# EAGLE schematic MainBoard (EAGLE 9.6.2)
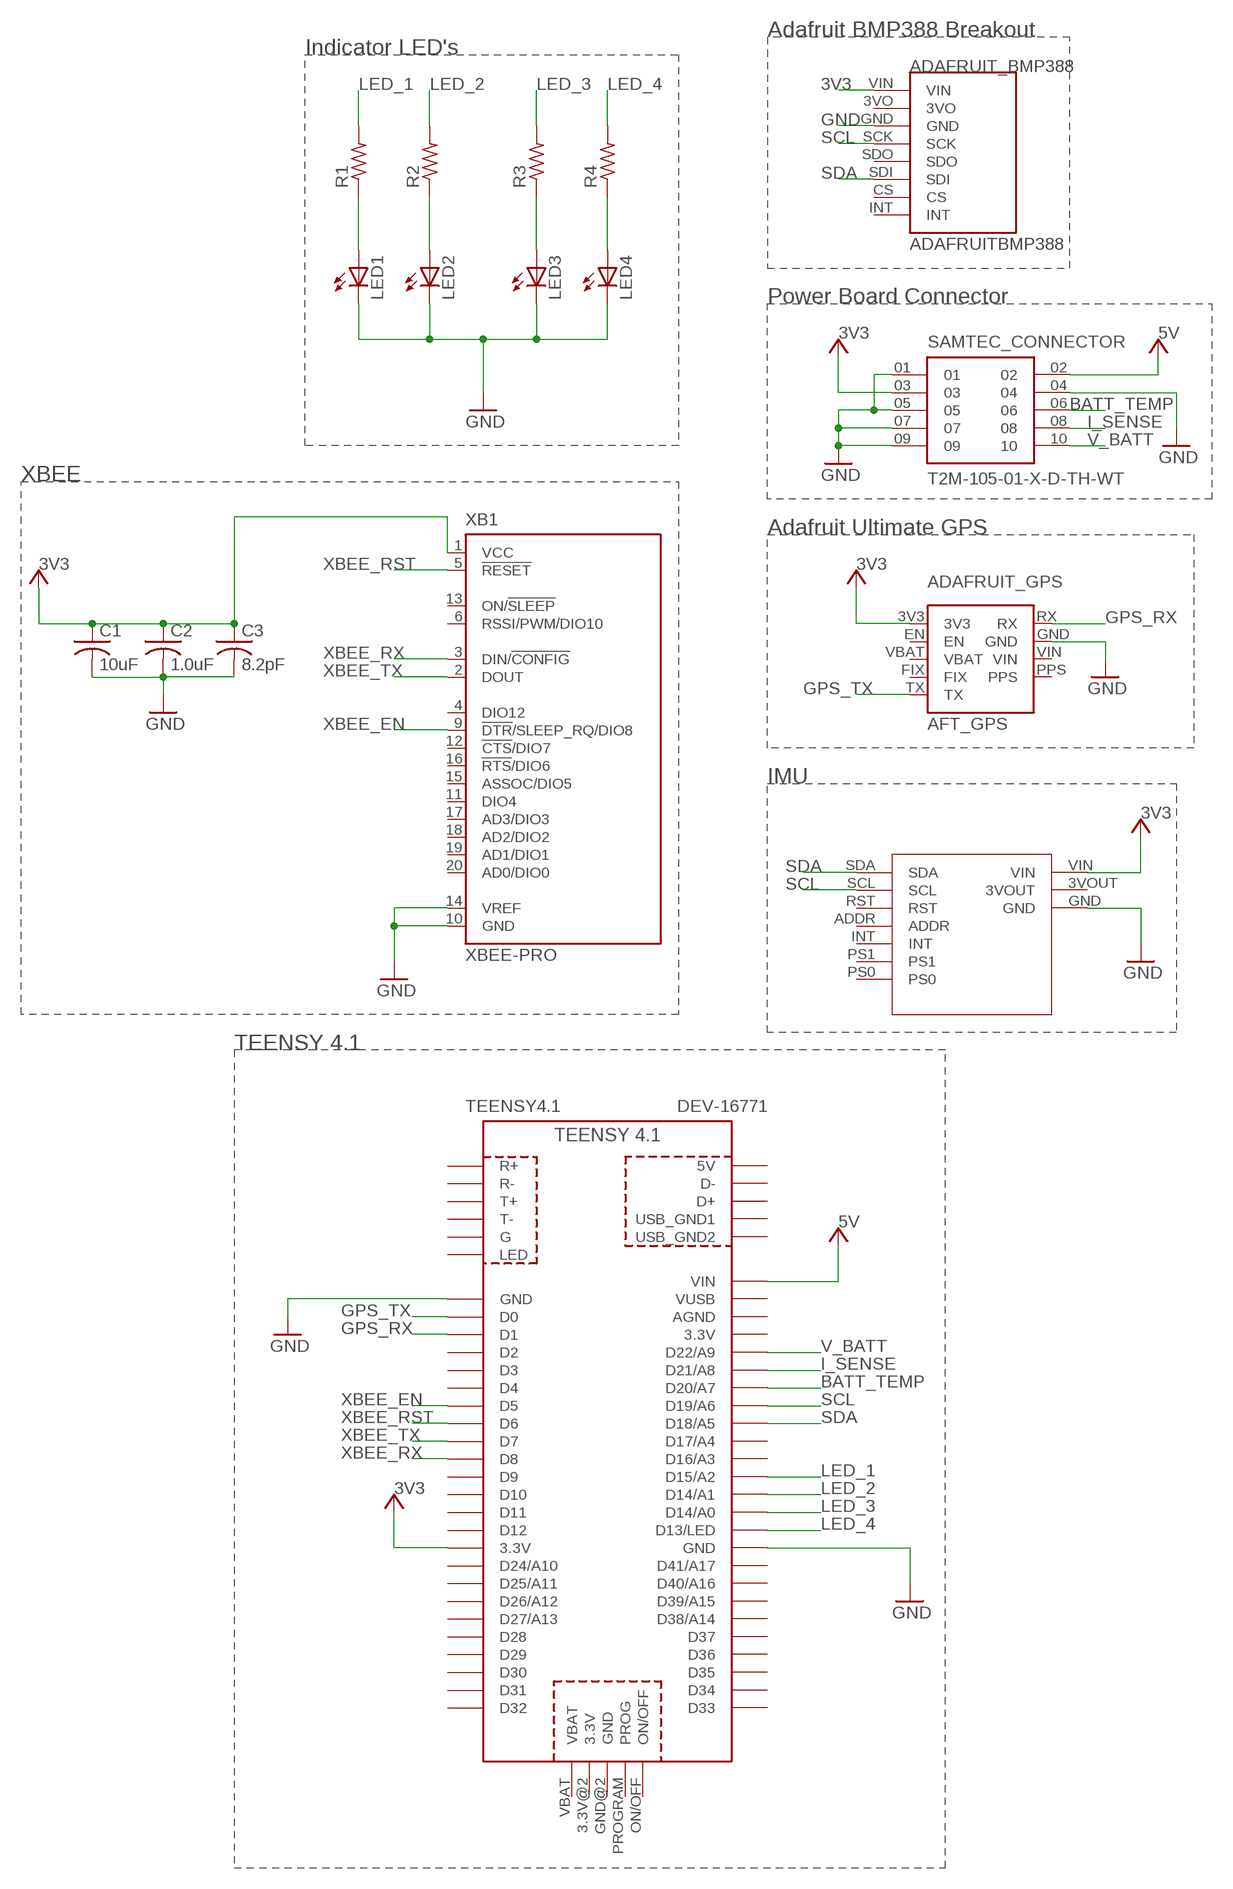
[diagram p0: schematic, sheet 1]

## Parts
ADAFRUIT_BMP388  ADAFRUITBMP388  [ADAFRUITBMP388]
ADAFRUIT_GPS  AFT_GPS  [AFT_GPS]
C1  10uF  C-USC0805  [C0805]
C2  1.0uF  C-USC0805  [C0805]
C3  8.2pF  C-USC0805  [C0805]
LED1  LED5MM  [LED5MM]
LED2  LED5MM  [LED5MM]
LED3  LED5MM  [LED5MM]
LED4  LED5MM  [LED5MM]
R1  R-US_R0805  [R0805]
R2  R-US_R0805  [R0805]
R3  R-US_R0805  [R0805]
R4  R-US_R0805  [R0805]
SAMTEC_CONNECTOR  T2M-105-01-X-D-TH-WT  [SAMTEC_T2M-105-01-X-D-TH-WT]
TEENSY4.1  DEV-16771  [DEV-16771]
U$1  IMU_BREAKOUT  [BNO055_BREAKOUT]
XB1  XBEE-PRO  [XBEE-PRO]

## Nets
3V3: ADAFRUIT_BMP388.VIN ADAFRUIT_GPS.3V3 C1.1 C2.1 C3.1 SAMTEC_CONNECTOR.03 TEENSY4.1.3.3V U$1.VIN XB1.1(VCC) ; supply symbol labelled VCC
5V: SAMTEC_CONNECTOR.02 TEENSY4.1.VIN ; supply symbol labelled VCC
BATT_TEMP: SAMTEC_CONNECTOR.06 TEENSY4.1.D21/A7(D20/A7)
GND: ADAFRUIT_BMP388.GND ADAFRUIT_GPS.GND C1.2 C2.2 C3.2 LED1.K(C) LED2.K(C) LED3.K(C) LED4.K(C) SAMTEC_CONNECTOR.01 SAMTEC_CONNECTOR.04 SAMTEC_CONNECTOR.05 SAMTEC_CONNECTOR.07 SAMTEC_CONNECTOR.09 TEENSY4.1.GND TEENSY4.1.GND@1(GND) U$1.GND XB1.10(GND) XB1.14(VREF)
GPS_RX: ADAFRUIT_GPS.RX TEENSY4.1.D1
GPS_TX: ADAFRUIT_GPS.TX TEENSY4.1.D0
I_SENSE: SAMTEC_CONNECTOR.08 TEENSY4.1.D22/A8(D21/A8)
LED_1: R1.2 TEENSY4.1.D16/A2(D15/A2)
LED_2: R2.2 TEENSY4.1.D15/A1(D14/A1)
LED_3: R3.2 TEENSY4.1.D14/A0
LED_4: R4.2 TEENSY4.1.D13/LED
N$8: LED1.A R1.1
N$9: LED2.A R2.1
N$10: LED3.A R3.1
N$11: LED4.A R4.1
SCL: ADAFRUIT_BMP388.SCK TEENSY4.1.D20/A6(D19/A6) U$1.SCL
SDA: ADAFRUIT_BMP388.SDI TEENSY4.1.D19/A5(D18/A5) U$1.SDA
V_BATT: SAMTEC_CONNECTOR.10 TEENSY4.1.D23/A9(D22/A9)
XBEE_EN: TEENSY4.1.D5 XB1.9(!DTR!/SLEEP_RQ/DIO8)
XBEE_RST: TEENSY4.1.D6 XB1.5(!RESET)
XBEE_RX: TEENSY4.1.D8 XB1.3(DIN/!CONFIG)
XBEE_TX: TEENSY4.1.D7 XB1.2(DOUT)
Unconnected: ADAFRUIT_BMP388.3VO ADAFRUIT_BMP388.CS ADAFRUIT_BMP388.INT ADAFRUIT_BMP388.SDO ADAFRUIT_GPS.EN ADAFRUIT_GPS.FIX ADAFRUIT_GPS.PPS ADAFRUIT_GPS.VBAT ADAFRUIT_GPS.VIN TEENSY4.1.D2 TEENSY4.1.D3 TEENSY4.1.D4 TEENSY4.1.D9 TEENSY4.1.D10 TEENSY4.1.D11 TEENSY4.1.D12 TEENSY4.1.D17/A3(D16/A3) TEENSY4.1.D18/A4(D17/A4) TEENSY4.1.D24/A10 TEENSY4.1.D25/A11 TEENSY4.1.D26/A12 TEENSY4.1.D27/A13 TEENSY4.1.D28 TEENSY4.1.D29 TEENSY4.1.D30 TEENSY4.1.D31 TEENSY4.1.D32 TEENSY4.1.D33 TEENSY4.1.D34 TEENSY4.1.D35 TEENSY4.1.D36 TEENSY4.1.D37 TEENSY4.1.D38/A14 TEENSY4.1.D39/A15 TEENSY4.1.D40/A16 TEENSY4.1.D41/A17 TEENSY4.1.D+ TEENSY4.1.D- TEENSY4.1.LED TEENSY4.1.ON/OFF TEENSY4.1.PROGRAM(PROG) TEENSY4.1.R+ TEENSY4.1.R- TEENSY4.1.T+ TEENSY4.1.T- U$1.3VOUT U$1.ADDR U$1.INT U$1.PS0 U$1.PS1 U$1.RST XB1.4(DIO12) XB1.6(RSSI/PWM/DIO10) XB1.11(DIO4) XB1.12(!CTS!/DIO7) XB1.13(ON/!SLEEP) XB1.15(ASSOC/DIO5) XB1.16(!RTS!/DIO6) XB1.17(AD3/DIO3) XB1.18(AD2/DIO2) XB1.19(AD1/DIO1) XB1.20(AD0/DIO0)

## Notes on the sheet
- Adafruit BMP388 Breakout
- Indicator LED's
- Power Board Connector
- XBEE
- Adafruit Ultimate GPS
- IMU
- TEENSY 4.1

## Power pins joined to a net without a drawn wire
3.3V: TEENSY4.1.3.3V@1(3.3V) TEENSY4.1.3.3V@2(3.3V)
5V: TEENSY4.1.5V
AGND: TEENSY4.1.AGND
G: TEENSY4.1.G
GND: TEENSY4.1.GND@2(GND)
USB_GND1: TEENSY4.1.USB_GND(USB_GND1)
USB_GND2: TEENSY4.1.USB_GND@2(USB_GND2)
VBAT: TEENSY4.1.VBAT
VUSB: TEENSY4.1.VUSB

## Library data of the parts
ADAFRUIT_BMP388 = adafruit BMP388:ADAFRUITBMP388
ADAFRUIT_GPS = adafruit_Ultimate_GPS_Breakout:AFT_GPS
C1-C3 = adafruit(seeIMUBreakout):C-US: CAPACITOR, American symbol
LED1-LED4 = adafruit(seeIMUBreakout):LED: LED OSRAM: - CHIPLED LG R971, LG N971, LY N971, LG Q971, LY Q971, LO R971, LY R971 LH N974, LH R974 LS Q976, LO Q976, LY Q976 LO Q996 - Hyper CHIPLED LW Q18S LB Q993, LB Q99A, LB R99A - SideLED LS A670, LO A670, LY A670, LG A670, LP A670 LB A673, LV A673, LT A673, LW A673 LH A674 LY A675 LS A676, LA A676, LO A676, LY A676, LW A676 LS A679, LY A679, LG A679 - Hyper Micro SIDELED® LS Y876, LA Y876, LO Y876, LY Y876 LT Y87S - SmartLED LW L88C, LW L88S LB L89C, LB L89S, LG L890 LS L89K, LO L89K, LY L89K LS L896, LA L896, LO L896, LY L896 - TOPLED LS T670, LO T670, LY T670, LG T670, LP T670 LSG T670, LSP T670, LSY T670, LOP T670, LYG T670 LG T671, LOG T671, LSG T671 LB T673, LV T673, LT T673, LW T673 LH T674 LS T676, LA T676, LO T676, LY T676, LB T676, LH T676, LSB T676, LW T676 LB T67C, LV T67C, LT T67C, LS T67K, LO T67K, LY T67K, LW E67C LS E67B, LA E67B, LO E67B, LY E67B, LB E67C, LV E67C, LT E67C LW T67C LS T679, LY T679, LG T679 LS T770, LO T770, LY T770, LG T770, LP T770 LB T773, LV T773, LT T773, LW T773 LH T774 LS E675, LA E675, LY E675, LS T675 LS T776, LA T776, LO T776, LY T776, LB T776 LHGB T686 LT T68C, LB T68C - Hyper Mini TOPLED® LB M676 - Mini TOPLED Santana® LG M470 LS M47K, LO M47K, LY M47K Source: http://www.osram.convergy.de/
R1-R4 = adafruit(seeIMUBreakout):R-US_: RESISTOR, American symbol
SAMTEC_CONNECTOR = T2M-105-01-X-D-TH-WT:T2M-105-01-X-D-TH-WT; MANUFACTURER: Samtec; MAXIMUM_PACKAGE_HEIGHT: 6.55mm; PARTREV: AH; STANDARD: Manufacturer Recommendations
TEENSY4.1 = DEV-16771(Teensy 4.1):DEV-16771: Teensy 4.1 i.MX ARM® Cortex®-M7 MPU Embedded Evaluation Board Check prices <https://pricing.snapeda.com/parts/DEV-16771/SparkFun%20Electronics/view-part?ref=eda>; AVAILABILITY: Warning; DESCRIPTION: RT1062 Teensy 4.1 i.MX ARM® Cortex®-M7 MPU Embedded Evaluation Board; MF: SparkFun Electronics; MP: DEV-16771; PACKAGE: None; PRICE: None; PURCHASE-URL: https://pricing.snapeda.com/search/part/DEV-16771/?ref=eda
U$1 = adafruit(seeIMUBreakout):IMU_BREAKOUT
XB1 = xbee:XBEE: XBee (TM) /XBee-PRO(TM) OEM RF Modules Source: MaxStream, Inc. xbee_productmanual.pdf; MPN: XBP24-AWI-001; OC_FARNELL: 1337916; OC_NEWARK: 42M2667